# Altium schematic sheet MostekH.SchDoc: MostekH
size A4; Author: Grzegorz Pietrzykowski; Revision: v1
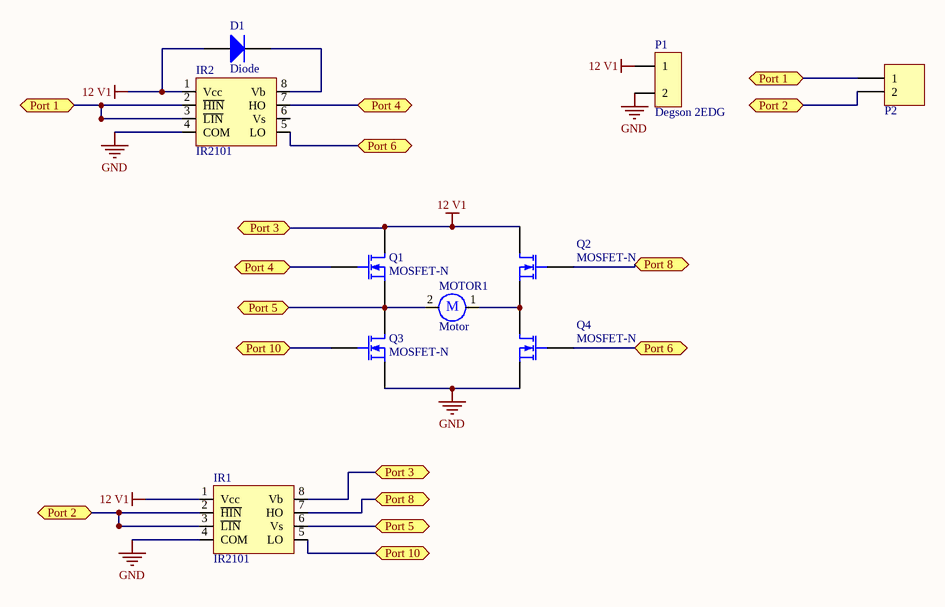
[diagram p0: MostekH.SchDoc]

## Parts
D1  Diode  [SMC]
IR1  IR2101  [PCBComponent_1]
IR2  IR2101  [PCBComponent_1]
MOTOR1  Motor  [HDR1X2]
P1  Degson 2EDG  [2EDGRC]
P2  HDR1X2  [HDR1X2]  (value not drawn)
Q1  MOSFET-N  [E3]
Q2  MOSFET-N  [E3]
Q3  MOSFET-N  [E3]
Q4  MOSFET-N  [E3]

## Ports
Port 1, Port 2, Port 3, Port 4, Port 5, Port 6, Port 8, Port 10

## Nets
12 V1: D1.1(A) IR1.1(Vcc) IR1.8(Vb) IR2.1(Vcc) P1.1 Q1.1(D) Q2.1(D) ; port Port 3
GND: IR1.4(COM) IR2.4(COM) P1.2 Q3.3(S) Q4.3(S)
Port 1: IR2.2(~{HIN}) IR2.3(~{LIN}) P2.1 ; port Port 1
Port 2: IR1.2(~{HIN}) IR1.3(~{LIN}) P2.2 ; port Port 2
Port 4: IR2.7(HO) Q1.2(G) ; port Port 4
Port 5: IR1.6(Vs) MOTOR1.2 Q1.3(S) Q3.1(D) ; port Port 5
Port 6: IR2.5(LO) Q4.2(G) ; port Port 6
Port 8: IR1.7(HO) Q2.2(G) ; port Port 8
Port 10: IR1.5(LO) Q3.2(G) ; port Port 10
NetD1_2: D1.2(K) IR2.8(Vb)
NetMOTOR1_1: MOTOR1.1 Q2.3(S) Q4.1(D)

Not connected (* = marked no-connect by the designer): IR2 6(Vs)

## Notes on the sheet
- (in symbol Motor) M

## Library data of the parts
D1 = Diode: Default Diode; Published: 8-Jun-2000; LatestRevisionDate: 17-Jul-2002; LatestRevisionNote: Re-released for DXP Platform.; PackageVersion: Sep-1996; PackageReference: SMC; Publisher: Altium Limited; PackageDescription: DO-214-AB/SMC; 2 C-Bend Leads; Body 7.9 x 5.9 mm, inc. leads (LxW); Code_JEDEC: DO-214-AB
MOTOR1 = Motor: Motor, General Kind; Published: 24-Mar-1999; LatestRevisionDate: 17-Jul-2002; LatestRevisionNote: Re-released for DXP Platform.; PackageReference: RB5-10.5; Publisher: Altium Limited
P2 = HDR1X2: Header, 2-Pin; LatestRevisionDate: 17-Jul-2002; LatestRevisionNote: Re-released for DXP Platform.; Publisher: Altium Limited
Q1-Q4 = MOSFET-N: N-Channel MOSFET; Published: 8-Jun-2000; LatestRevisionDate: 17-Jul-2002; LatestRevisionNote: Re-released for DXP Platform.; PackageVersion: 1995/1996; PackageReference: E3; Publisher: Altium Limited; PackageDescription: TO, Flat Index; 3 In-Line, Axial Leads; Body Dia. 4.6mm; Lead Dia. 0.5 mm (max)